# Altium schematic sheet SubsystemA.SchDoc
size A4; SheetNumber: 1; SheetTotal: 1
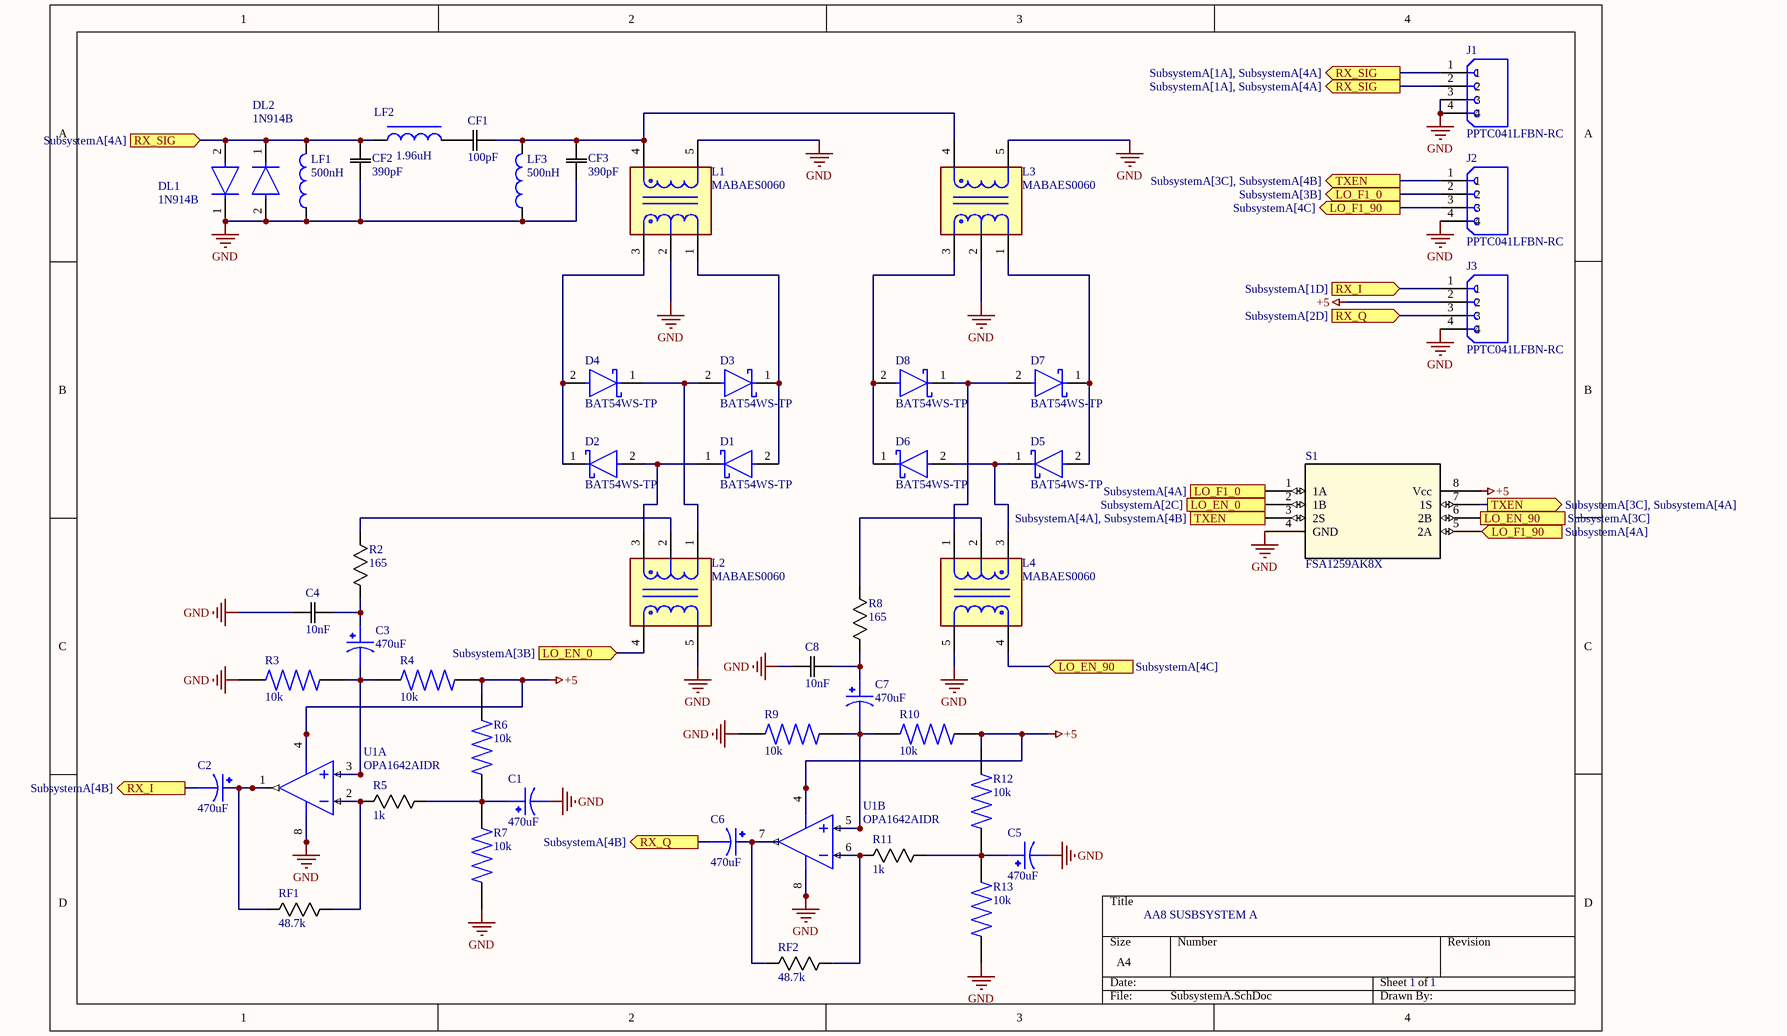
[diagram p0: SubsystemA.SchDoc]

## Parts
C1  470uF  [CAPPRD500W60D1050H2200]
C2  470uF  [CAPPRD500W60D1050H2200]
C3  470uF  [CAPPRD500W60D1050H2200]
C4  10nF  [CAP_C322C511_MR_KEM]
C5  470uF  [CAPPRD500W60D1050H2200]
C6  470uF  [CAPPRD500W60D1050H2200]
C7  470uF  [CAPPRD500W60D1050H2200]
C8  10nF  [CAP_C322C511_MR_KEM]
CF1  100pF  [CAP_FKP20101001D00KSSD_WIM]
CF2  390pF  [CAP_J1_PAN]
CF3  390pF  [CAP_J1_PAN]
D1  BAT54WS-TP  [FP-SOD-323-IPC_B]
D2  BAT54WS-TP  [FP-SOD-323-IPC_B]
D3  BAT54WS-TP  [FP-SOD-323-IPC_B]
D4  BAT54WS-TP  [FP-SOD-323-IPC_B]
D5  BAT54WS-TP  [FP-SOD-323-IPC_B]
D6  BAT54WS-TP  [FP-SOD-323-IPC_B]
D7  BAT54WS-TP  [FP-SOD-323-IPC_B]
D8  BAT54WS-TP  [FP-SOD-323-IPC_B]
DL1  1N914B  [FP-017AG-MFG]
DL2  1N914B  [FP-017AG-MFG]
J1  PPTC041LFBN-RC  [SULLINS_PPTC041LFBN-RC]
J2  PPTC041LFBN-RC  [SULLINS_PPTC041LFBN-RC]
J3  PPTC041LFBN-RC  [SULLINS_PPTC041LFBN-RC]
L1  MABAES0060  [FP-MABAES0060-MFG]
L2  MABAES0060  [FP-MABAES0060-MFG]
L3  MABAES0060  [FP-MABAES0060-MFG]
L4  MABAES0060  [FP-MABAES0060-MFG]
LF1  500nH  [INDC1608X100N]
LF2  1.96uH  [7847229020]
LF3  500nH  [INDC1608X100N]
R2  165  [RES_MFR25_6P3X2P4_YAG]
R3  10k  [RESAD1100W55L680D260]
R4  10k  [RESAD1100W55L680D260]
R5  1k  [YAG_MF25_YAG]
R6  10k  [RESAD1100W55L680D260]
R7  10k  [RESAD1100W55L680D260]
R8  165  [RES_MFR25_6P3X2P4_YAG]
R9  10k  [RESAD1100W55L680D260]
R10  10k  [RESAD1100W55L680D260]
R11  1k  [YAG_MF25_YAG]
R12  10k  [RESAD1100W55L680D260]
R13  10k  [RESAD1100W55L680D260]
RF1  48.7k  [YAG_MF25_YAG]
RF2  48.7k  [YAG_MF25_YAG]
S1  FSA1259AK8X  [US8-8_2P1X2P4_ONS]
U1  OPA1642AIDR  [D0008A_M]  (parts A,B of 2)

## Ports
LO_EN_0 (in, see SubsystemA[3B]), LO_EN_0 (out, see SubsystemA[2C]), LO_EN_90 (in, see SubsystemA[4C]), LO_EN_90 (out, see SubsystemA[3C]), LO_F1_0 (in, see SubsystemA[4A]), LO_F1_0 (out, see SubsystemA[3B]), LO_F1_90 (in, see SubsystemA[4A]), LO_F1_90 (out, see SubsystemA[4C]), RX_I (in, see SubsystemA[1D]), RX_I (out, see SubsystemA[4B]), RX_Q (in, see SubsystemA[2D]), RX_Q (out, see SubsystemA[4B]), RX_SIG (in, see SubsystemA[4A]), RX_SIG (out, see SubsystemA[1A], SubsystemA[4A]), TXEN (out, see SubsystemA[3C], SubsystemA[4A]), TXEN (out, see SubsystemA[3C], SubsystemA[4B]), TXEN (out, see SubsystemA[4A], SubsystemA[4B])

## Nets
+5: J3.2 R4.1 R6.2 R10.1 R12.1 S1.8(Vcc) U1.4(V-)
GND: C1.2 C4.1 C5.2 C8.1 CF2.1 CF3.1 DL1.1(C) DL2.2(A) J1.3 J1.4 J2.4 J3.4 L1.2(Secondary_CT) L1.5(Primary) L2.5(Primary) L3.2(Secondary_CT) L3.5(Primary) L4.5(Primary) LF1.1 LF3.1 R3.2 R7.1 R9.2 R13.2 S1.4(GND) U1.8(V+)
LO_EN_0: L2.4(Primary_dot) S1.2(1B) ; port LO_EN_0
LO_EN_90: L4.4(Primary_dot) S1.6(2B) ; port LO_EN_90
LO_F1_0: J2.2 S1.1(1A) ; port LO_F1_0
LO_F1_90: J2.3 S1.5(2A) ; port LO_F1_90
RX_I: C2.2 J3.1 ; port RX_I
RX_Q: C6.2 J3.3 ; port RX_Q
RX_SIG: CF2.2 DL1.2(A) DL2.1(C) J1.1 J1.2 LF1.2 LF2.1 ; port RX_SIG
TXEN: J2.1 S1.3(2S) S1.7(1S) ; port TXEN
NetC1_1: C1.1 R5.2 R6.1 R7.2
NetC2_1: C2.1 RF1.2 U1.1(OUT_A)
NetC3_1: C3.1 C4.2 R2.1
NetC3_2: C3.2 R3.1 R4.2 U1.3(IN_A+)
NetC5_1: C5.1 R11.2 R12.2 R13.1
NetC6_1: C6.1 RF2.2 U1.7(OUT_B)
NetC7_1: C7.1 C8.2 R8.1
NetC7_2: C7.2 R9.1 R10.2 U1.5(IN_B+)
NetCF1_1: CF1.1 LF2.2
NetCF1_2: CF1.2 CF3.2 L1.4(Primary_dot) L3.4(Primary_dot) LF3.2
NetD1_1: D1.1(C) D2.2(A) L2.3(Secondary_Dot)
NetD1_2: D1.2(A) D3.1(C) L1.1(Secondary)
NetD2_1: D2.1(C) D4.2(A) L1.3(Secondary_Dot)
NetD3_2: D3.2(A) D4.1(C) L2.1(Secondary)
NetD5_1: D5.1(C) D6.2(A) L4.3(Secondary_Dot)
NetD5_2: D5.2(A) D7.1(C) L3.1(Secondary)
NetD6_1: D6.1(C) D8.2(A) L3.3(Secondary_Dot)
NetD7_2: D7.2(A) D8.1(C) L4.1(Secondary)
NetL2_2: L2.2(Secondary_CT) R2.2
NetL4_2: L4.2(Secondary_CT) R8.2
NetR5_1: R5.1 RF1.1 U1.2(IN_A-)
NetR11_1: R11.1 RF2.1 U1.6(IN_B-)

## Notes on the sheet
- AA8 SUSBSYSTEM A
- 1

## Library data of the parts
C1-C3 C5-C7 = UPW1V471MPD: Availability: Unavailable; Price: None; Value: *; MP: UPW1V471MPD; Package: None
C4 C8 = C322C103K3G5TA: No Description Available; Manufacturer_Name: Kemet; Copyright: Copyright (C) 2026 Ultra Librarian. All rights reserved.; Manufacturer_Part_Number: C322C103K3G5TA
CF1 = FKP2O101001D00KSSD: Description; Manufacturer_Name: Wima; Copyright: Copyright (C) 2025 Ultra Librarian. All rights reserved.; Manufacturer_Part_Number: FKP2O101001D00KSSD
CF2 CF3 = ECH-U1H391GX5: No Description Available; Manufacturer_Name: Panasonic; Copyright: Copyright (C) 2026 Ultra Librarian. All rights reserved.; Manufacturer_Part_Number: ECH-U1H391GX5
D1-D8 = CMP-56206-000013-1: DIODE SCHOTTKY 30V 200MA SOD323; Max Reverse Leakage Current: 500nA; Element Configuration: Single; Forward Voltage: 1V; Polarity: Standard; Power Dissipation: 200mW; Peak Non-Repetitive Surge Current: 600mA; Reverse Recovery Time: 5ns; Capacitance: 2pF; Max Reverse Current: 2uA; Average Rectified Current: 200mA; Number of Pins: 2; Max Reverse Voltage (DC): 30V; Min Operating Temperature: -55°C; Radiation Hardening: No; Current Rating: 200mA; Max Operating Temperature: 125°C; Output Current: 200mA; Max Forward Surge Current (Ifsm): 200mA; Voltage Rating (DC): 30V; Mount: Surface Mount; Height: 1mm; Lead Free: Lead Free; Max Repetitive Reverse Voltage (Vrrm): 30V; Forward Current: 200mA; Width: 1.35mm; Packaging: Tape and Reel; RoHS Compliant: Yes; Package Quantity: 1; Length: 1.8mm
DL1 DL2 = CMP-07163-000001-1: DIODE GEN PURP 100V 200MA DO35; Manufacturer: ON Semiconductor; Forward Current: 300mA; Max Junction Temp: +175°C; Peak Reverse Current: 5uA; Value: 4pF; Max Surge Forward Current: 1A; Device Class L1: Discrete Semiconductors; Manufacturer Part Number: 1N914B; Automotive: No; Temperature: -55°C to +175°C; Temperature Range Low: -55°C; Reverse Voltage: 100V; Category: Diode; Footprint Url: https://www.onsemi.com/pub/Collateral/017AG.PDF; Package: 017AG; Lead Free: Yes; Digikey Description: DIODE GEN PURP 100V 200MA DO35; Height: 1.91mm; Device Class L3: Rectifier Diodes; ComponentLink2URL: https://www.onsemi.com/pub/Collateral/1N914-D.PDF; Octopart: https://octopart.com/1n914b-on+semiconductor-84323163; Capacitance: 4pF; Device Class L2: Diodes; Mouser Description: Diodes - General Purpose, Power, Switching 100V Io/200mA BULK; RoHS: TRUE; Max Repetitive Reverse Voltage: 100V; Temperature Range High: +175°C; ComponentLink2Description: Datasheet
J1-J3 = PPTC041LFBN-RC: 4 Position Header Connector 0.100 (2.54mm) Through Hole Tin; MF: Sullins Connector; SnapEDA_Link: https://www.snapeda.com/parts/PPTC041LFBN-RC/Sullins/view-part/?ref=snap; Package: None; Value: *; MP: PPTC041LFBN-RC; Check_prices: https://www.snapeda.com/parts/PPTC041LFBN-RC/Sullins/view-part/?ref=eda
L1-L4 = CMP-97513-000003-1: BALUN 300KHZ-200MHZ 1:1 6SMD; Insertion Loss: 1.5dB; Lead/Base Style: Gull Wing; Max DC Current: 500mA; Power Rating: 500mW; Package Quantity: 2000; Lead Free: Lead Free; Case/Package: SMD/SMT; Number of Pins: 5; Width: 3.81mm; Turns Ratio: 1:1; Depth: 3.81mm; Height: 2.67mm; Min Operating Temperature: -40°C; Termination: SMD/SMT; Length: 3.81mm; Max Operating Temperature: 85°C; Packaging: Tape and Reel; Radiation Hardening: No; Mount: Surface Mount
LF1 LF3 = BRC1608TR50M6: 500 nH Unshielded Drum Core, Wirewound Inductor 1.05 A 90mOhm 0603 (1608 Metric); MF: Taiyo Yuden; SnapEDA_Link: https://www.snapeda.com/parts/BRC1608TR50M6/Taiyo+Yuden/view-part/?ref=snap; Package: 1608 Taiyo Yuden; Value: *; MP: BRC1608TR50M6; Check_prices: https://www.snapeda.com/parts/BRC1608TR50M6/Taiyo+Yuden/view-part/?ref=eda
LF2 = CMP-03913-112295598-3: Inductor, 1.96Uh, Unshielded, 15A Rohs Compliant: Yes; Inductance: 1.96µH; DC Resistance (DCR): 2.4mΩ; Pin Length: 5.5mm; Min Operating Temperature: -40°C; Current Rating: 15A; Height: 10mm; Length: 18mm; Max Operating Temperature: 150°C; RoHS: Compliant; Ambient Temperature Range Low: -40°C; Diameter: 9.3mm; Ambient Temperature Range High: 110°C
R2 R8 = MFR-25FRF52-165R: No Description Available; Manufacturer_Name: Yageo; Copyright: Copyright (C) 2026 Ultra Librarian. All rights reserved.; Manufacturer_Part_Number: MFR-25FRF52-165R
R3 R4 R6 R7 R9 R10 R12 R13 = MFR-25FRF52-10K: 10.5 kOhms Â±1% 0.25W, 1/4W Through Hole Resistor Axial - Metal Film; MF: Yageo; SnapEDA_Link: https://www.snapeda.com/parts/MFR-25FRF52-10K/Yageo/view-part/?ref=snap; Package: RADIAL-2 YAGEO; Value: *; MP: MFR-25FRF52-10K; Check_prices: https://www.snapeda.com/parts/MFR-25FRF52-10K/Yageo/view-part/?ref=eda
R5 R11 = MFR-25FRF52-1K: Description; Manufacturer_Name: Yageo; Copyright: Copyright (C) 2025 Ultra Librarian. All rights reserved.; Manufacturer_Part_Number: MFR-25FRF52-1K
RF1 RF2 = MFR-25FBF52-48K7: No Description Available; Manufacturer_Name: Yageo; Copyright: Copyright (C) 2026 Ultra Librarian. All rights reserved.; Manufacturer_Part_Number: MFR-25FBF52-48K7
S1 = FSA1259AK8X: No Description Available; Manufacturer_Name: onsemi / Fairchild Semiconductor; Copyright: Copyright (C) 2026 Ultra Librarian. All rights reserved.; Manufacturer_Part_Number: FSA1259AK8X; RefDes: RefDes; Type: Type
U1 = CMP-0808-00011-2: Sound-Plus High-Performance, JFET-Input Audio Operational Amplifier, 4.5 to 36 V, -40 to 85 degC, 8-pin SOIC (D8), Green (RoHS & no Sb/Br); Manufacturer: Texas Instruments; Vn at Flatband(Typ)(nV/rtHz): 5.1; Vmin(V): 5; GBW(Typ)(MHz): 11; Number of Channels: 2; Iq per channel(Max)(mA): 2.3; Vmax(V): 36; ComponentLink1Description: Manufacturer URL; ComponentLink3URL: http://www.ti.com/litv/pdf/msoi002j; PackageReference: D0008A; Eco-Plan: Green (RoHS & no Sb/Br); PartNumber: OPA1642AIDR; ComponentLink3Description: Package Specification; ComponentLink2Description: Datasheet; PackageVersion: 4040047-3/M, 06/2011; SubFamily: Audio Operational Amplifier; ComponentLink1URL: http://www.ti.com/; Mounting Technology: Surface Mount; Code_JEDEC: MS-012; PackageDescription: 8-Pin Plastic Small Outline, Body 4.9 x 3.9 mm, Pitch 1.27 mm; DatasheetVersion: SBOS484B; ComponentLink2URL: http://www.ti.com/general/docs/lit/getliterature.tsp?genericPartNumber=OPA1642&fileType=pdf